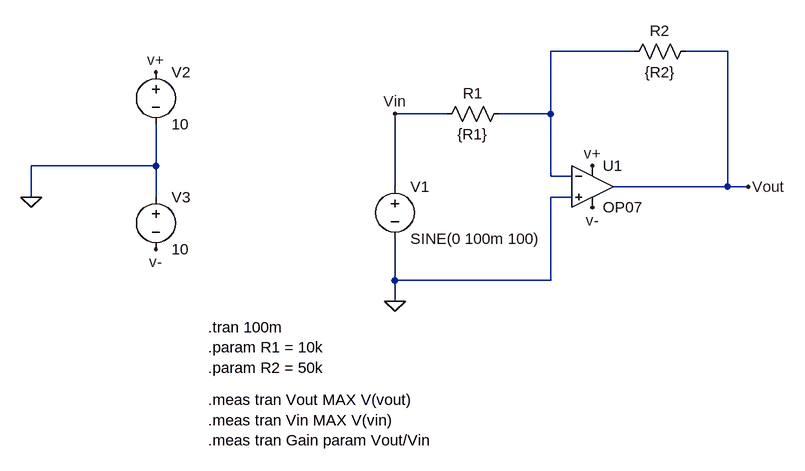
[diagram p0: schematic NavarroRodGeryk_CPE160P_A1_CourseWork1.asc]
NavarroRodGeryk_CPE160P_A1_CourseWork1.asc, the LTspice schematic file:
Version 4
SHEET 1 1064 680
WIRE 816 -368 688 -368
WIRE 960 -368 896 -368
WIRE 528 -272 448 -272
WIRE 688 -272 688 -368
WIRE 688 -272 608 -272
WIRE 80 -192 80 -256
WIRE 80 -192 -112 -192
WIRE 688 -176 688 -272
WIRE 720 -176 688 -176
WIRE 448 -160 448 -272
WIRE 960 -160 960 -368
WIRE 960 -160 784 -160
WIRE 992 -160 960 -160
WIRE -112 -144 -112 -192
WIRE 80 -144 80 -192
WIRE 720 -144 688 -144
WIRE 448 -16 448 -80
WIRE 688 -16 688 -144
WIRE 688 -16 448 -16
WIRE 448 16 448 -16
FLAG 448 16 0
FLAG -112 -144 0
FLAG 80 -336 v+
FLAG 80 -64 v-
FLAG 752 -128 v-
FLAG 752 -192 v+
FLAG 448 -272 Vin
FLAG 992 -160 Vout
SYMBOL voltage 448 -176 R0
WINDOW 123 0 0 Left 0
WINDOW 39 0 0 Left 0
SYMATTR InstName V1
SYMATTR Value SINE(0 100m 100)
SYMBOL voltage 80 -352 R0
WINDOW 123 0 0 Left 0
WINDOW 39 0 0 Left 0
SYMATTR InstName V2
SYMATTR Value 10
SYMBOL voltage 80 -160 R0
WINDOW 123 0 0 Left 0
WINDOW 39 0 0 Left 0
SYMATTR InstName V3
SYMATTR Value 10
SYMBOL res 624 -288 R90
WINDOW 0 0 56 VBottom 2
WINDOW 3 32 56 VTop 2
SYMATTR InstName R1
SYMATTR Value {R1}
SYMBOL res 912 -384 R90
WINDOW 0 0 56 VBottom 2
WINDOW 3 32 56 VTop 2
SYMATTR InstName R2
SYMATTR Value {R2}
SYMBOL OpAmps\\OP07 752 -224 R0
SYMATTR InstName U1
TEXT 160 56 Left 2 !.tran 100m\n.param R1 = 10k\n.param R2 = 50k
TEXT 160 168 Left 2 !.meas tran Vout MAX V(vout)\n.meas tran Vin MAX V(vin)\n.meas tran Gain param Vout/Vin

The netlist it stands for:
* NavarroRodGeryk_CPE160P_A1_CourseWork1.asc
V1 Vin 0 SINE(0 100m 100)
V2 v+ 0 10
V3 0 v- 10
R1 N001 Vin {R1}
R2 Vout N001 {R2}
XU1 0 N001 v+ v- Vout LT1001  ; OP07, pins In+ In- V+ V- OUT
.tran 100m
.param R1 = 10k
.param R2 = 50k
.meas tran Vout MAX V(vout)
.meas tran Vin MAX V(vin)
.meas tran Gain param Vout/Vin
.lib LTC.lib
.backanno
.end

* Results of the author's LTspice run, read from the files saved beside the schematic
* Operating Point, zero values left out:
*   V(v+) = 10 V
*   V(v-) = -10 V
*   I(V3) = -2.25 mA
*   I(V2) = -2.25 mA
*   Ix(u1:3) = 2.25 mA
*   Ix(u1:4) = -2.25 mA
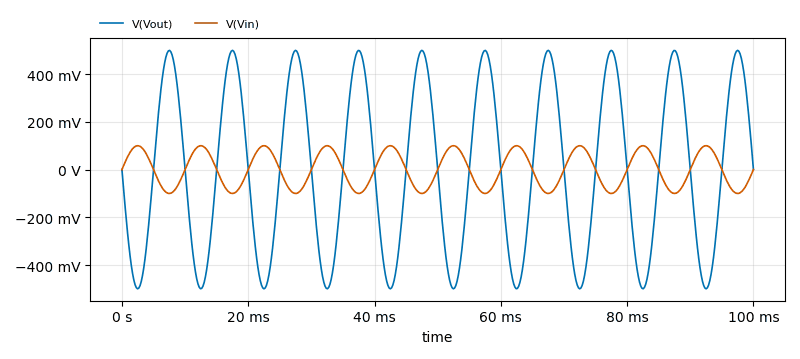
[diagram p1: Transient Analysis of NavarroRodGeryk_CPE160P_A1_CourseWork1.asc, plotted from the saved traces]
* Transient Analysis, 1 run:
*   V(Vout): min -499.5 mV, max 499.5 mV, average 0 V, rms 353.2 mV, last 352.1 µV
*   V(Vin): min -100 mV, max 100 mV, average 0 V, rms 70.71 mV, last 0 V
* From the log:
*   vout: MAX(v(vout))=0.499516 FROM 0 TO 0.1
*   vin: MAX(v(vin))=0.0999985 FROM 0 TO 0.1
*   gain: vout/vin=4.99524